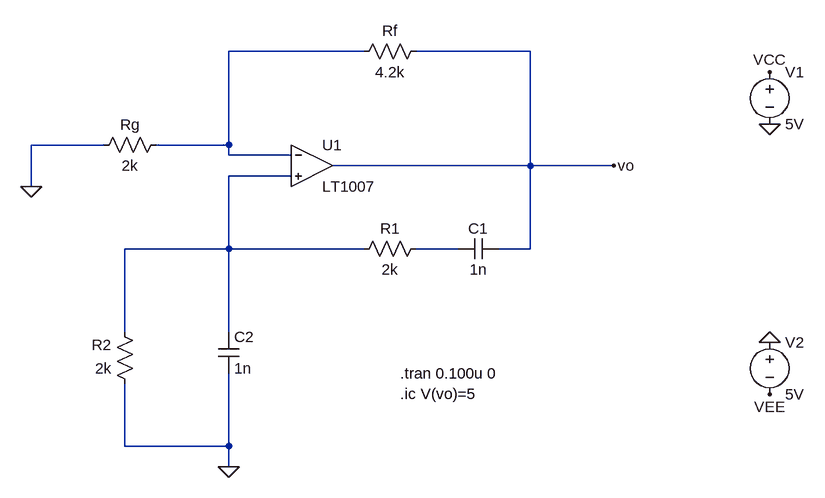
[diagram p0: schematic wien-bridge-oscillator.asc]
wien-bridge-oscillator.asc, the LTspice schematic file:
Version 4.1
SHEET 1 880 692
WIRE -272 32 -480 32
WIRE -16 32 -192 32
WIRE -672 176 -784 176
WIRE -480 176 -480 32
WIRE -480 176 -592 176
WIRE -480 192 -480 176
WIRE -384 192 -480 192
WIRE -16 208 -16 32
WIRE -16 208 -320 208
WIRE 112 208 -16 208
WIRE -384 224 -480 224
WIRE -784 240 -784 176
WIRE -480 336 -480 224
WIRE -480 336 -640 336
WIRE -272 336 -480 336
WIRE -128 336 -192 336
WIRE -16 336 -16 208
WIRE -16 336 -64 336
WIRE -640 464 -640 336
WIRE -480 464 -480 336
WIRE -640 640 -640 544
WIRE -480 640 -480 528
WIRE -480 640 -640 640
WIRE -480 672 -480 640
FLAG 352 560 VEE
FLAG 352 480 0
FLAG 352 144 0
FLAG 352 64 VCC
FLAG -784 240 0
FLAG 112 208 vo
FLAG -480 672 0
SYMBOL voltage 352 48 R0
WINDOW 123 0 0 Left 0
WINDOW 39 0 0 Left 0
SYMATTR InstName V1
SYMATTR Value 5V
SYMBOL voltage 352 464 R0
SYMATTR InstName V2
SYMATTR Value 5V
SYMBOL res -176 16 R90
WINDOW 0 0 56 VBottom 2
WINDOW 3 32 56 VTop 2
SYMATTR InstName Rf
SYMATTR Value 4.2k
SYMBOL res -576 160 R90
WINDOW 0 0 56 VBottom 2
WINDOW 3 32 56 VTop 2
SYMATTR InstName Rg
SYMATTR Value 2k
SYMBOL res -176 320 R90
WINDOW 0 0 56 VBottom 2
WINDOW 3 32 56 VTop 2
SYMATTR InstName R1
SYMATTR Value 2k
SYMBOL res -624 560 R180
WINDOW 0 36 76 Left 2
WINDOW 3 36 40 Left 2
SYMATTR InstName R2
SYMATTR Value 2k
SYMBOL OpAmps\\LT1007 -352 144 R0
SYMATTR InstName U1
SYMBOL cap -64 320 R90
WINDOW 0 0 32 VBottom 2
WINDOW 3 32 32 VTop 2
SYMATTR InstName C1
SYMATTR Value 1n
SYMBOL cap -496 464 R0
SYMATTR InstName C2
SYMATTR Value 1n
TEXT -216 528 Left 2 !.tran 0.100u 0\n.ic V(vo)=5

The netlist it stands for:
* wien-bridge-oscillator.asc
V1 VCC 0 5V
V2 0 VEE 5V
Rf vo N001 4.2k
Rg N001 0 2k
R1 N003 N002 2k
R2 0 N002 2k
X§U1 N002 N001 NC_01 NC_02 vo LT1007  ; pins In+ In- V+ V- OUT
C1 vo N003 1n
C2 N002 0 1n
.tran 0.100u 0
.ic V(vo)=5
.lib LTC.lib
.backanno
.end